# Altium schematic sheet PCB_Headers.SchDoc
size A4; DocumentNumber: 6; SheetNumber: 6; SheetTotal: 8
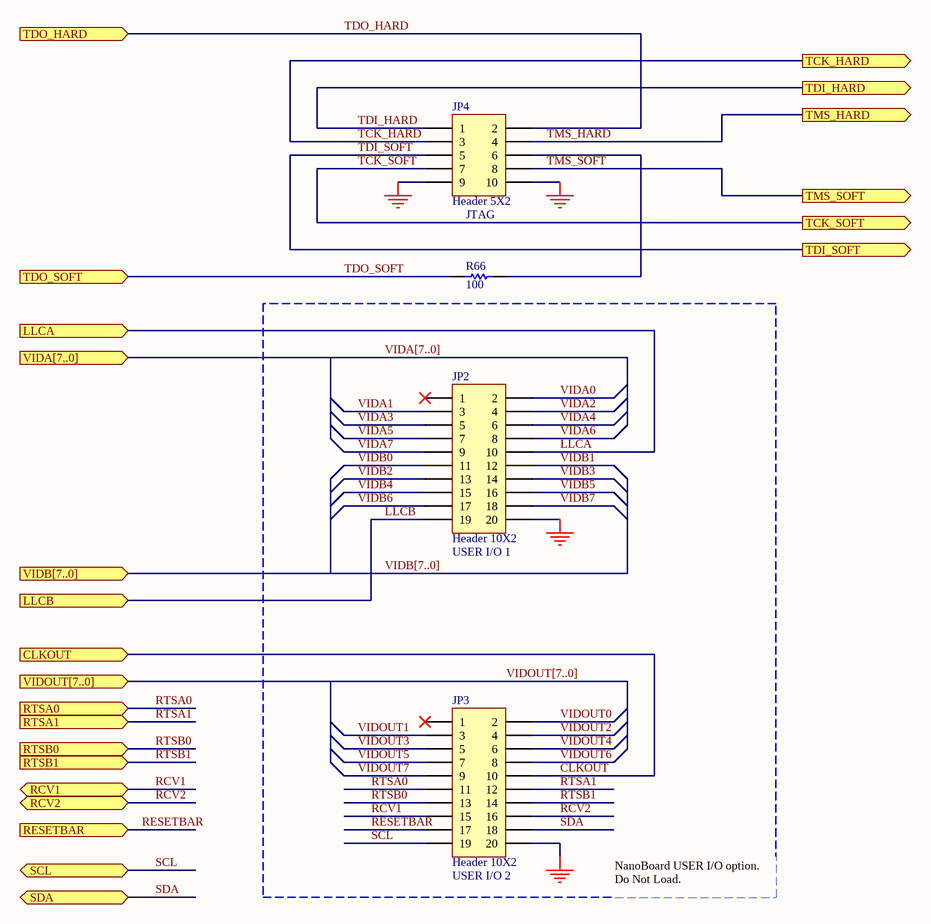
[diagram p0: PCB_Headers.SchDoc]

## Parts
JP2  Header 10X2  [HDR2X10]
JP3  Header 10X2  [HDR2X10]
JP4  Header 5X2  [HDR2X5]
R66  100  [CC2012-0805]

## Ports
CLKOUT (in), LLCA (in), LLCB (in), RCV1 (bidir), RCV2 (bidir), RESETBAR (in), RTSA0 (in), RTSA1 (in), RTSB0 (in), RTSB1 (in), SCL (bidir), SDA (bidir), TCK_HARD (out), TCK_SOFT (out), TDI_HARD (out), TDI_SOFT (out), TDO_HARD (in), TDO_SOFT (in), TMS_HARD (out), TMS_SOFT (out), VIDA[7..0] (in), VIDB[7..0] (in), VIDOUT[7..0] (in)

## Nets
GND: JP2.20 JP3.20 JP4.9 JP4.10
CLKOUT: JP3.10 ; port CLKOUT
LLCA: JP2.10 ; port LLCA
LLCB: JP2.19 ; port LLCB
RCV1: JP3.15 ; port RCV1
RCV2: JP3.16 ; port RCV2
RESETBAR: JP3.17 ; port RESETBAR
RTSA0: JP3.11 ; port RTSA0
RTSA1: JP3.12 ; port RTSA1
RTSB0: JP3.13 ; port RTSB0
RTSB1: JP3.14 ; port RTSB1
SCL: JP3.19 ; port SCL
SDA: JP3.18 ; port SDA
TCK_HARD: JP4.3 ; port TCK_HARD
TCK_SOFT: JP4.7 ; port TCK_SOFT
TDI_HARD: JP4.1 ; port TDI_HARD
TDI_SOFT: JP4.5 ; port TDI_SOFT
TDO_HARD: JP4.2 ; port TDO_HARD
TDO_SOFT: R66.1 ; port TDO_SOFT
TMS_HARD: JP4.4 ; port TMS_HARD
TMS_SOFT: JP4.8 ; port TMS_SOFT
VIDA0: JP2.2
VIDA1: JP2.3
VIDA2: JP2.4
VIDA3: JP2.5
VIDA4: JP2.6
VIDA5: JP2.7
VIDA6: JP2.8
VIDA7: JP2.9
VIDB0: JP2.11
VIDB1: JP2.12
VIDB2: JP2.13
VIDB3: JP2.14
VIDB4: JP2.15
VIDB5: JP2.16
VIDB6: JP2.17
VIDB7: JP2.18
VIDOUT0: JP3.2
VIDOUT1: JP3.3
VIDOUT2: JP3.4
VIDOUT3: JP3.5
VIDOUT4: JP3.6
VIDOUT5: JP3.7
VIDOUT6: JP3.8
VIDOUT7: JP3.9
NetJP4_6: JP4.6 R66.2

Not connected (* = marked no-connect by the designer): JP2 1*; JP3 1*

## Buses and harness runs
bus VIDA[7..0] = port VIDA[7..0]
bus VIDB[7..0] = port VIDB[7..0]
bus VIDOUT[7..0] = port VIDOUT[7..0]

## Notes on the sheet
- (near JP4) JTAG
- (near JP2) USER I/O 1
- (near JP3) USER I/O 2
- NanoBoard USER I/O option. Do Not Load.

## Library data of the parts
JP2 JP3 = Header 10X2: Header, 10-Pin, Dual row; Manufacturer: Generic Components; Class I: Connector; Revision: July-2002: Re-released for DXP Platform.; Publisher: Altium Limited
JP4 = Header 5X2: Header, 5-Pin, Dual row; Manufacturer: Generic Components; Class I: Connector; Revision: July-2002: Re-released for DXP Platform.; Publisher: Altium Limited
R66 = RES: Resistor; Fitted: True